# EAGLE design 4-PT100-B (EAGLE 7.7.0)
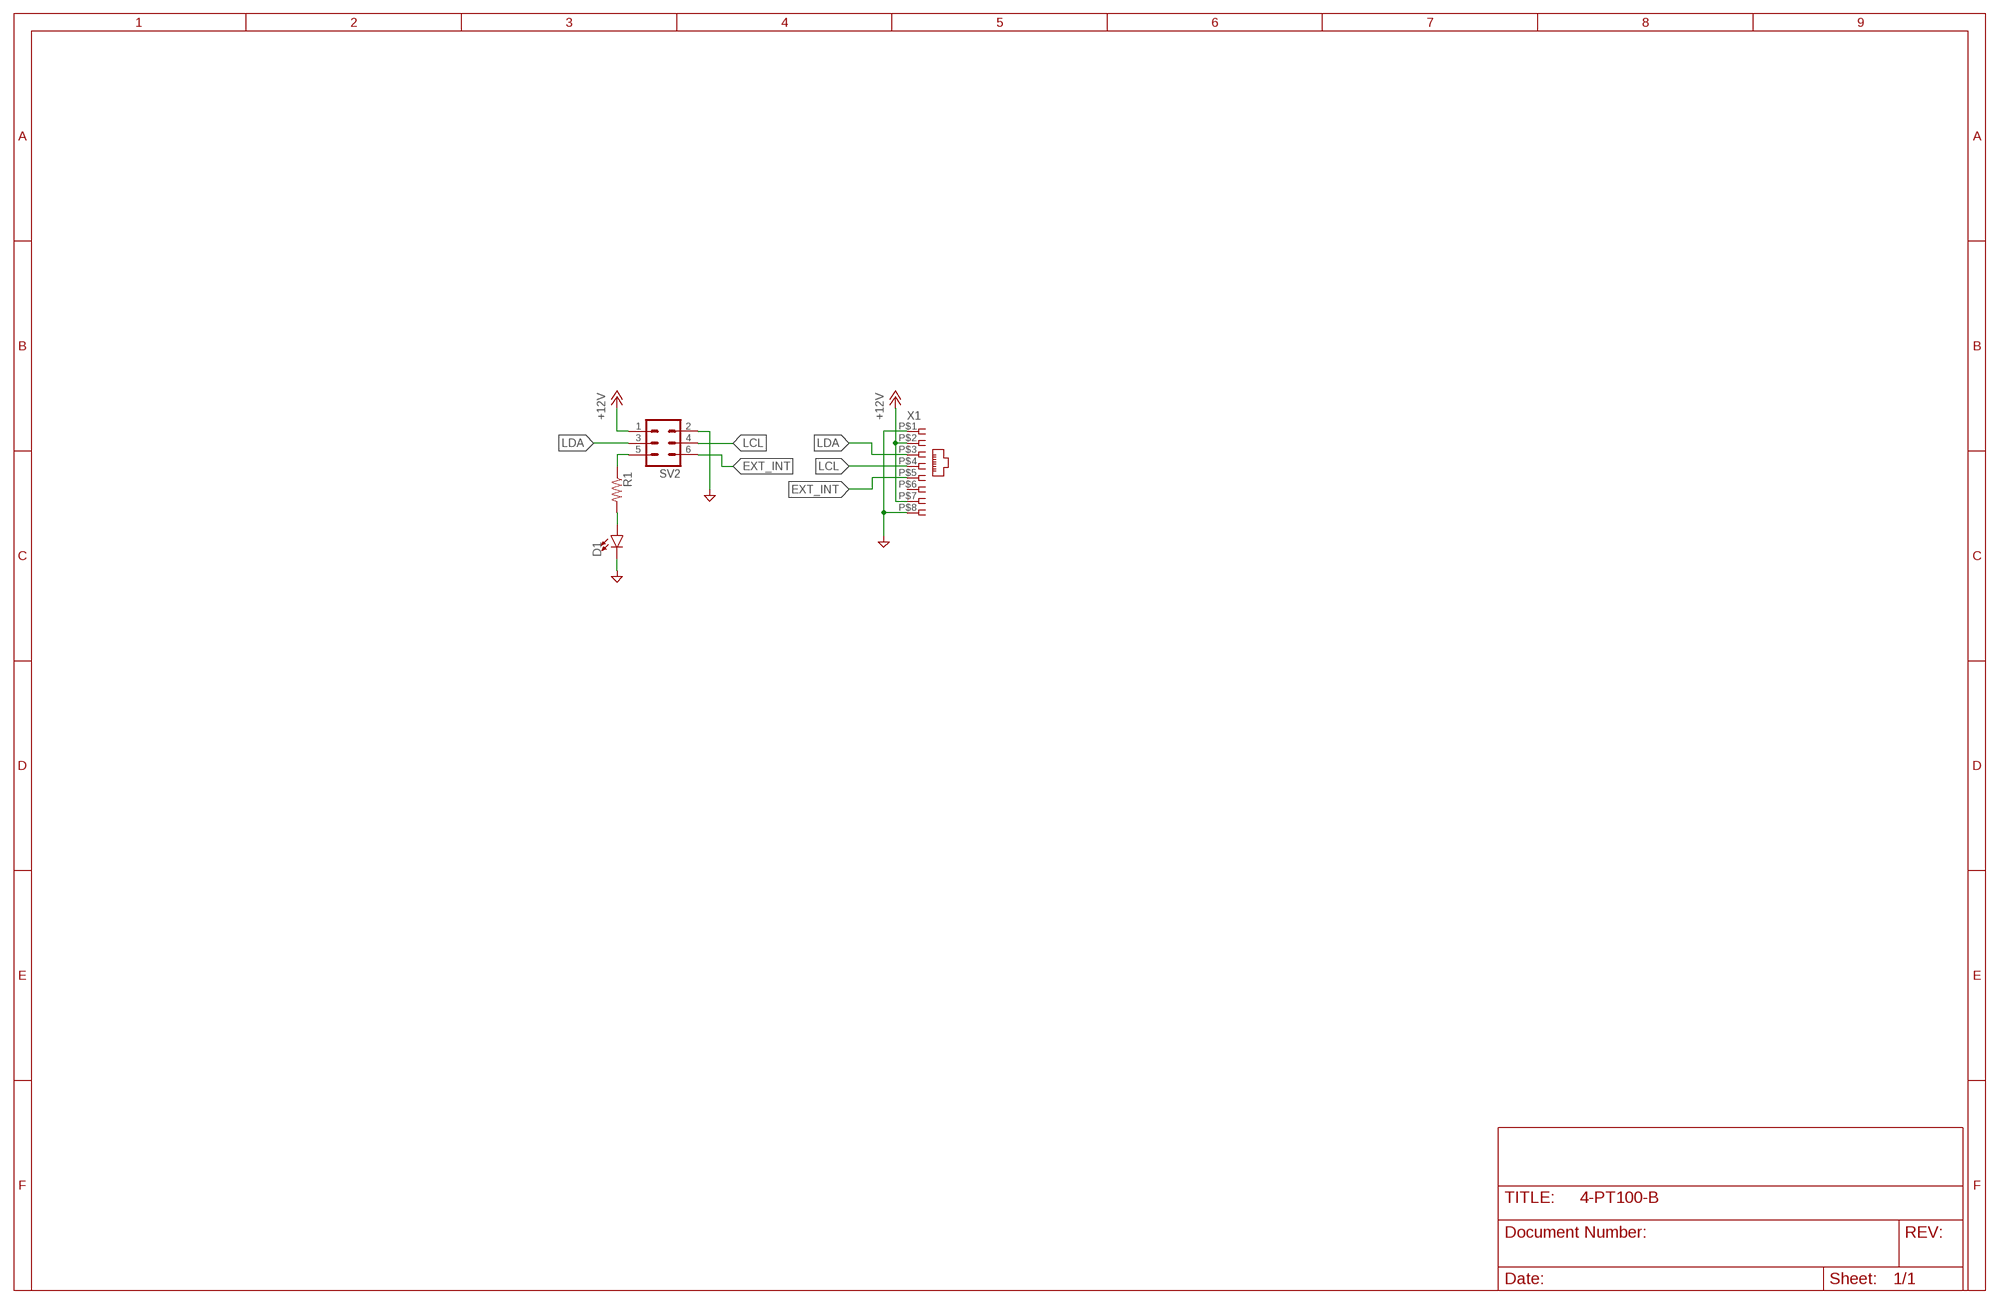
[diagram p0: schematic, sheet 1]

## Parts
D1  LED3MM  [LED_3MM]
R1  R-US_R0805  [R0805]
SV2  ML6  [ML6]
X1  RJ45  [RJ45-VERT]

## Nets
+12VBUS: SV2.1 X1.P$2 X1.P$7 ; supply symbol labelled +12V
DGND: D1.K(C) SV2.2 X1.P$1 X1.P$8 ; supply symbol labelled VDG
EXT_INT: SV2.6 X1.P$5
LCL: SV2.4 X1.P$4
LDA: SV2.3 X1.P$3
N$1: D1.A R1.2
N$13: R1.1 SV2.5
Unconnected: X1.P$6

## Library data of the parts
D1 = SparkFun-LED 2:LED: LED (Generic) Standard schematic elements and footprints for 5mm, 3mm, 1206, and 0603 sized LEDs. Generic LEDs with no color specified.; PROD_ID: DIO-08794
R1 = resistor:R-US_: RESISTOR, American symbol
SV2 = con-harting-ml:ML6: HARTING; OC_FARNELL: unknown; OC_NEWARK: unknown
X1 = Cedric:RJ45

## Board
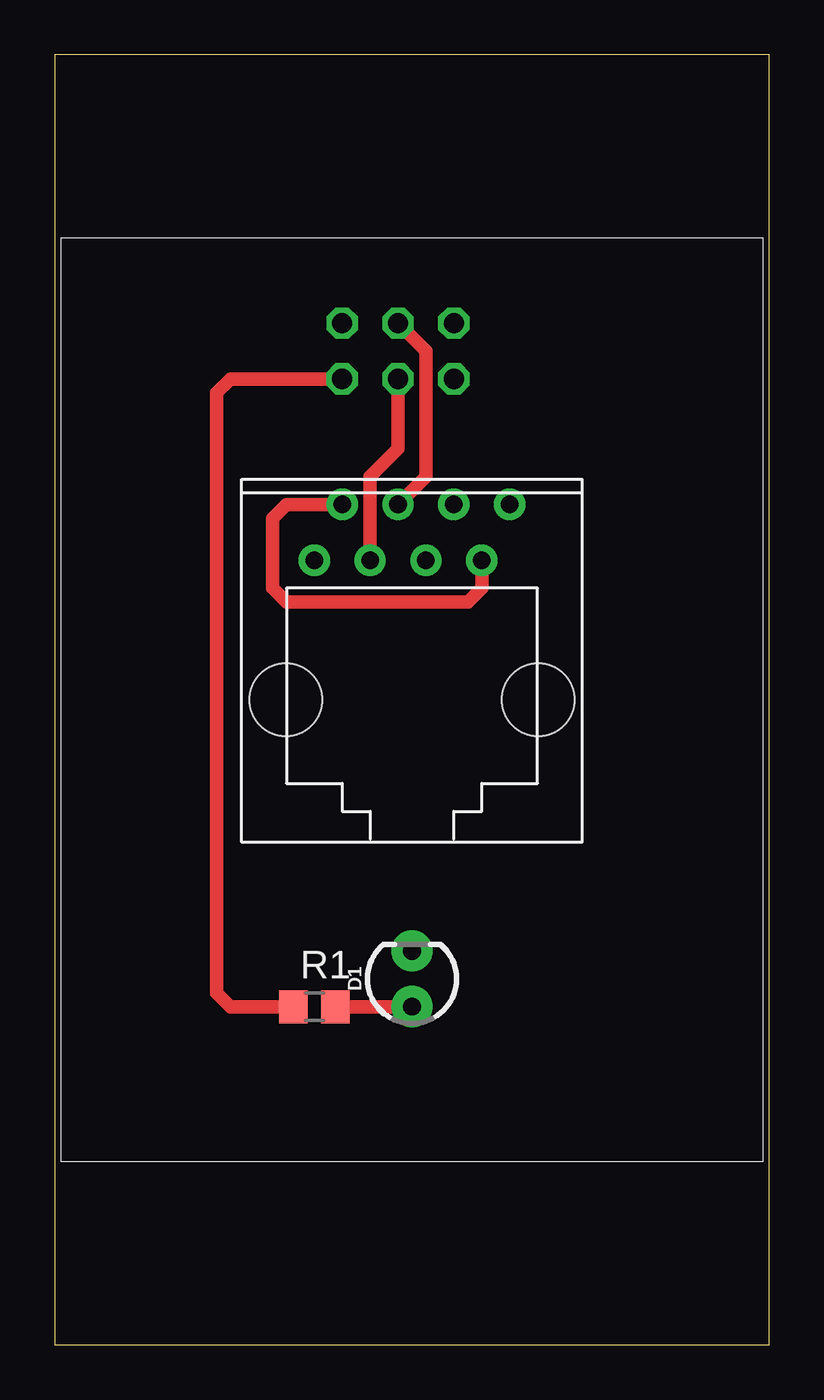
[diagram p1: board, top side]
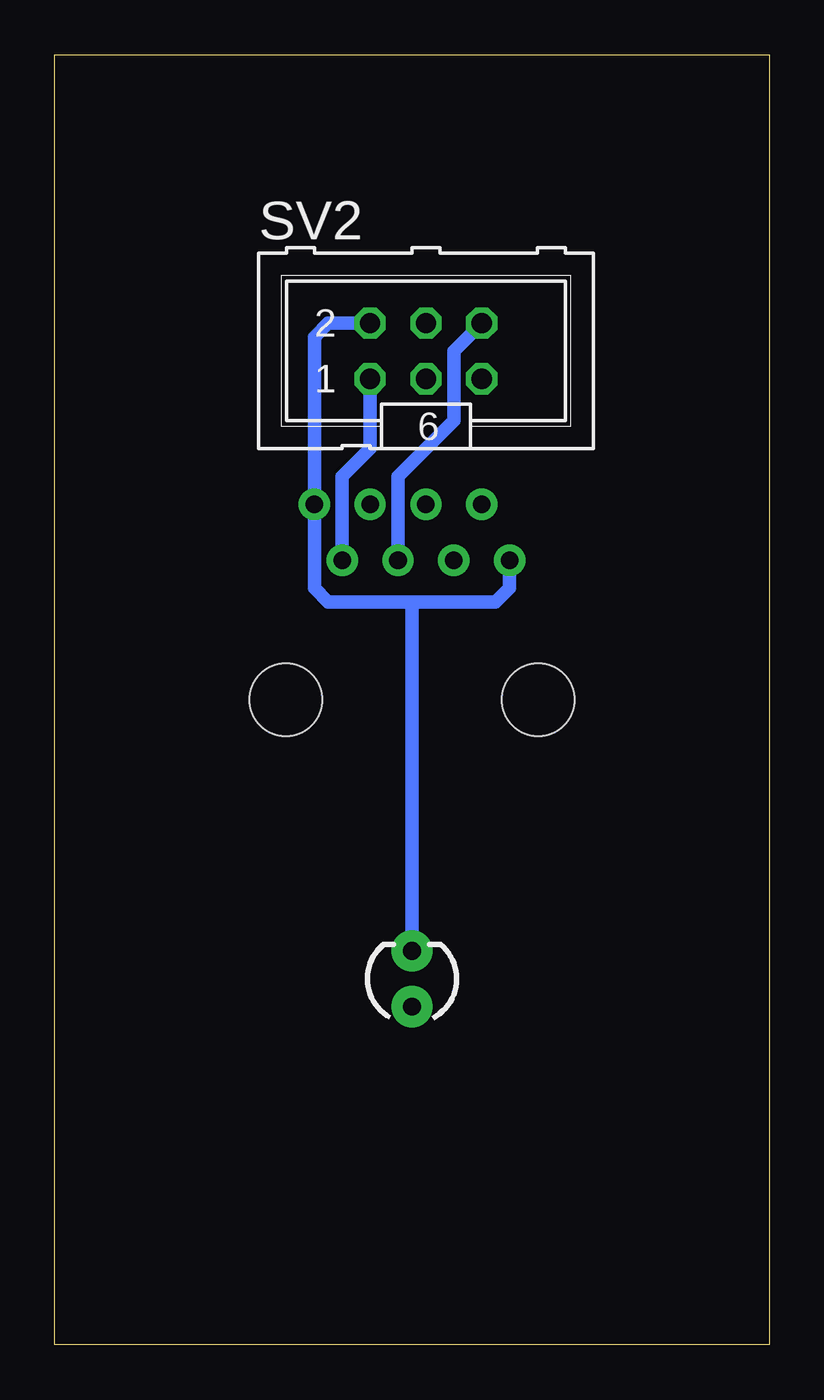
[diagram p2: board, bottom side, seen from below]

Size 32.51 x 58.7 mm. Coordinates in mm from the lower left corner, seen from the top.
Outline: 0,0 32.51,0 32.51,58.7 0,58.7 0,0
Copper layers (1*16): Top 0.035mm / dielectric 1.5mm / Bottom 0.035mm
Design rules "default": minimum track width 10mil, minimum drill 24mil, track to track 8mil, track to pad 8mil, pad to pad 8mil, via to via 8mil, smd to smd 8mil, copper to edge 40mil, drill to drill 8mil, minimum pad ring 10mil, minimum via ring 8mil, stop-mask expansion 4mil, vias tented up to drill 0mil, thermal gap 10mil
vRestrict: 2 lines

### Footprints (pad centres in the part's own frame; a part is rotated, then mirrored left to right if it is on the bottom)
LED_3MM = drill 0.813 pad 1.88: A -1.27,0; K 1.27,0
R0805 = smd 1.3 x 1.5: 1 -0.95,0; 2 0.95,0
ML6 = drill 0.914 octagon: 1 -2.54,-1.27; 2 -2.54,1.27; 3 0,-1.27; 4 0,1.27; 5 2.54,-1.27; 6 2.54,1.27
RJ45-VERT = drill 0.8 pad 1.422: P$1 -4.445,6.35; P$2 -3.175,8.89; P$3 -1.905,6.35; P$4 -0.635,8.89; P$5 0.635,6.35; P$6 1.905,8.89; P$7 3.175,6.35; P$8 4.445,8.89 | hole 3.302: -5.74,0; 5.74,0

### Placement (x,y rotation side)
D1  16.26,16.65 90 top
R1  11.81,15.38 0 top
SV2  15.62,45.22 0 bottom
X1  16.26,29.35 0 top

### Tracks (layer width: path | path; a pad name or v marks a point on that pad's centre or on a via)
+12VBUS
  Top 0.61: X1.P$2 10.54,38.24 9.91,37.6 9.91,34.43 10.54,33.79 18.8,33.79 19.43,34.43 X1.P$7
  Bottom 0.61: SV2.1 18.16,40.78 19.43,39.51 X1.P$7
DGND
  Bottom 0.61: X1.P$1 11.81,34.43 12.45,33.79 16.26,33.79 | 16.26,33.79 20.07,33.79 20.7,34.43 X1.P$8 20.7,45.86 20.07,46.49 SV2.2 | D1.K 16.26,33.79
EXT_INT
  Bottom 0.61: SV2.6 14.35,45.22 14.35,42.05 16.89,39.51 X1.P$5
LCL
  Top 0.61: SV2.4 16.89,45.22 16.89,39.51 X1.P$4
LDA
  Top 0.61: SV2.3 15.62,40.78 14.35,39.51 X1.P$3
N$1
  Top 0.61: R1.2 D1.A
N$13
  Top 0.61: R1.1 8,15.38 7.37,16.01 7.37,43.32 8,43.95 SV2.5